# EAGLE schematic mainboard (EAGLE 9.6.2)
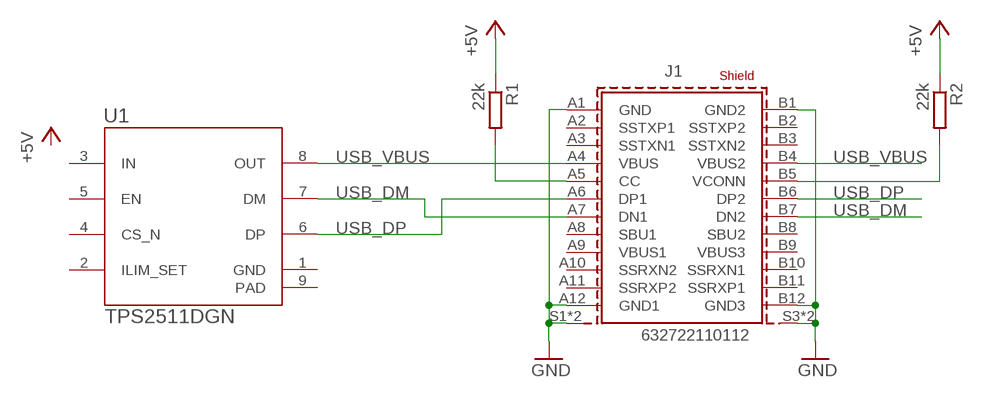
[diagram p0: schematic, sheet 1]

## Parts
J1  632722110112  [632722110112]
R1  22k  R-EU_R0603  [R0603]
R2  22k  R-EU_R0603  [R0603]
U1  TPS2511DGN  [VSSOP-8P]

## Nets
+5V: R1.1 R2.1
GND: J1.A1(GND) J1.A12(GND1) J1.B1(GND2) J1.B12(GND3) J1.S1(SHIELD) J1.S2(SHIELD) J1.S3(SHIELD1) J1.S4(SHIELD1)
N$1: J1.A5(CC) R1.2
N$2: J1.B5(VCONN) R2.2
USB_DM: J1.A7(DN1) J1.B7(DN2) U1.7(DM)
USB_DP: J1.A6(DP1) J1.B6(DP2) U1.6(DP)
USB_VBUS: J1.A4(VBUS) J1.B4(VBUS2) U1.8(OUT)
Unconnected: J1.A2(SSTXP1) J1.A3(SSTXN1) J1.A8(SBU1) J1.A9(VBUS1) J1.A10(SSRXN2) J1.A11(SSRXP2) J1.B2(SSTXP2) J1.B3(SSTXN2) J1.B8(SBU2) J1.B9(VBUS3) J1.B10(SSRXN1) J1.B11(SSRXP1) U1.2(ILIM_SET) U1.4(CS_N) U1.5(EN)

## Power pins joined to a net without a drawn wire
GND: U1.1(GND)
IN: U1.3(IN)
PAD: U1.9(PAD)

## Library data of the parts
J1 = Wurth_Connectors_WR-USB:632722110112: WR-COM USB 3.1 Type C Receptacle Vertical SMT 1.0 mm Kind Properties Durability:10 000 Mating cycles Gender: Receptacle Type:Vertical General Information Operating Temperature:-40up to +85 °C Compliance:Lead free / RoHS Electrical Properties IR 1:5A Working Voltage:20V (DC) Withstanding Voltage:100V (AC) Contact Resistance:40 mΩ Material Properties Insulator Material:LCP Insulator Flammability Rating:UL94 V-0 Color:Black Contact Material:Copper Alloy Contact Plating:Gold over Nickel Contact Type:Stamped Shielding Material:Stainless Steel Shielding Plating:Nickel <https://www.we-online.com/catalog/media/o77237v209%20Family_WR-USB31_632722110112.jpg> Details see: https://www.we-online.com/catalog/en/COM_3_1_SMT_TYPE_C_RECEPTACLE_HORIZONTAL_1_0MM/ Updated by Ella Wu 2020-08-05 2020 (C) Würth Elektronik; APPLICATION: USB 3.1; DATASHEET-URL: https://www.we-online.com/catalog/datasheet/632722110112.pdf; GERDER: Receptacle; INTERFACE-TYPE: Type C; IR1: 5A; MOUNT: SMT; PACKAGING: Tape and Reel; PART-NUMBER: 632722110112; PINS: 24; TYPE: Vertical; WORKING-VOLTAGE: 20V(DC)
R1 R2 = rcl:R-EU_: RESISTOR, European symbol; SPICEPREFIX: R
U1 = Aktiv:TPS2511; MANUFACTURER: Texas Instruments; OC_DIGIKEY: 296-30552-1-ND; PARTNUMBER: TPS2511DGNR; REFDES: RefDes; TYPE: TYPE; VALUE: Value